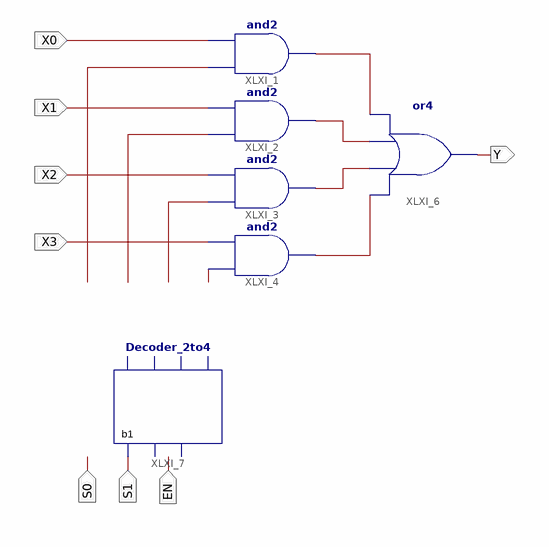
[diagram p0: schematic sheet 1]
// Xilinx ISE schematic MUX_4to1.sch (spartan3e) as structural Verilog: 6 symbols, 8 ports
module MUX_4to1 (
  input  X0,
  input  X1,
  input  X2,
  input  X3,
  input  S0,
  input  S1,
  input  EN,
  output Y
);

  wire XLXN_1, XLXN_2, XLXN_3, XLXN_5, XLXN_11, XLXN_13, XLXN_14, XLXN_15;

  and XLXI_1 (XLXN_11, XLXN_5, X0);
  and XLXI_2 (XLXN_13, XLXN_3, X1);
  and XLXI_3 (XLXN_14, XLXN_2, X2);
  and XLXI_4 (XLXN_15, XLXN_1, X3);
  or XLXI_6 (Y, XLXN_15, XLXN_14, XLXN_13, XLXN_11);
  Decoder_2to4 XLXI_7 (.b0(S0), .b1(S1), .EN(EN), .Y0(XLXN_5), .Y1(XLXN_3), .Y2(XLXN_2), .Y3(XLXN_1));
endmodule
